# EAGLE design VisualightMicroDIY_02 (EAGLE 6.2)
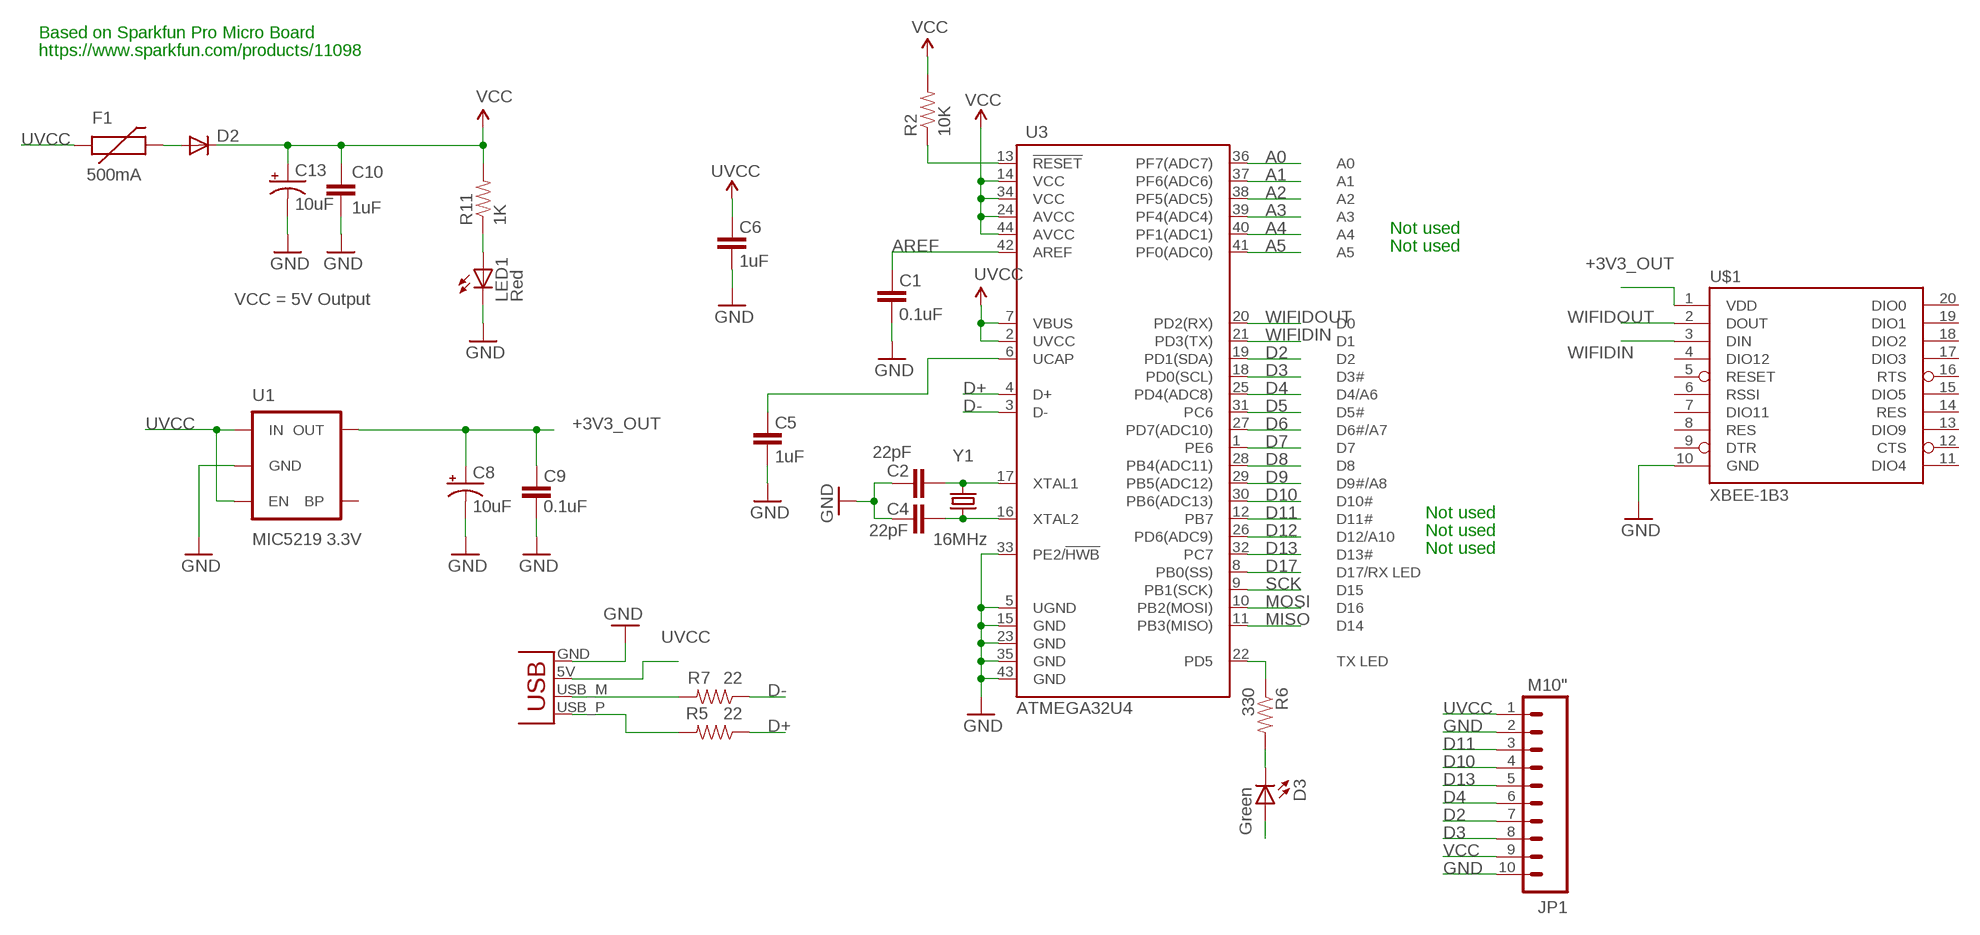
[diagram p0: schematic, sheet 1]

## Parts
C1  0.1uF  CAP0402-CAP  [0402-CAP]
C2  22pF  CAP0402-CAP  [0402-CAP]
C4  22pF  CAP0402-CAP  [0402-CAP]
C5  1uF  CAP0402-CAP  [0402-CAP]
C6  1uF  CAP0402-CAP  [0402-CAP]
C8  10uF  CAP_POL1206  [EIA3216]
C9  0.1uF  CAP0402-CAP  [0402-CAP]
C10  1uF  CAP0402-CAP  [0402-CAP]
C13  10uF  CAP_POL1206  [EIA3216]
D2  DIODESOD  [SOD-323]
D3  Green  LED0603  [LED-0603]
F1  500mA  PTCSMD  [PTC-1206]
JP1  M10"  [1X10]
LED1  Red  LED0603  [LED-0603]
R2  10K  RESISTOR0402-RES  [0402-RES]
R5  22  RESISTOR0402-RES  [0402-RES]
R6  330  RESISTOR0402-RES  [0402-RES]
R7  22  RESISTOR0402-RES  [0402-RES]
R11  1K  RESISTOR0402-RES  [0402-RES]
U1  MIC5219 3.3V  V_REG_MIC52193.3V  [SOT23-5]
U3  ATMEGA32U4  ATMEGA32U4TQFP  [SPARKFUN-DIGITALIC_TQFP44]
U$1  XBEE-1B3  [XBEE-SMD]
X2  USBPCB  [USB-A-PCB]
Y1  16MHz  CRYSTAL5X3  [CRYSTAL-SMD-5X3]

## Nets
+3V3_OUT: C8.A(+) C9.2 U1.5(OUT) U$1.1(VDD)
A0: U3.36(PF7(ADC7))
A1: U3.37(PF6(ADC6))
A2: U3.38(PF5(ADC5))
A3: U3.39(PF4(ADC4))
A4: U3.40(PF1(ADC1))
A5: U3.41(PF0(ADC0))
AREF: C1.2 U3.42(AREF)
D2: JP1.7 U3.19(PD1(SDA))
D3: JP1.8 U3.18(PD0(SCL))
D4: JP1.6 U3.25(PD4(ADC8))
D5: U3.31(PC6)
D6: U3.27(PD7(ADC10))
D7: U3.1(PE6)
D8: U3.28(PB4(ADC11))
D9: U3.29(PB5(ADC12))
D10: JP1.4 U3.30(PB6(ADC13))
D11: JP1.3 U3.12(PB7)
D12: U3.26(PD6(ADC9))
D13: JP1.5 U3.32(PC7)
D17: U3.8(PB0(SS))
D+: R5.1 U3.4(D+)
D-: R7.1 U3.3(D-)
GND [vcc]: C1.1 C2.2 C4.2 C5.1 C6.1 C8.C(-) C9.1 C10.2 C13.C(-) JP1.2 JP1.10 LED1.C U1.2(GND) U3.5(UGND) U3.15(GND) U3.23(GND) U3.33(PE2/!HWB) U3.35(GND) U3.43(GND) U$1.10(GND) X2.GND
MISO: U3.11(PB3(MISO))
MOSI: U3.10(PB2(MOSI))
N$1: C4.1 U3.16(XTAL2) Y1.1
N$2: C2.1 U3.17(XTAL1) Y1.3
N$4: C5.2 U3.6(UCAP)
N$6: R7.2 X2.USB_M(D-)
N$7: D3.C R6.2
N$8: R5.2 X2.USB_P(D+)
N$9: D2.2(A) F1.2
N$38: LED1.A R11.1
RESET: R2.1 U3.13(!RESET)
SCK: U3.9(PB1(SCK))
TXLED: R6.1 U3.22(PD5)
UVCC: C6.2 D3.A F1.1 JP1.1 U1.1(IN) U1.3(EN) U3.2(UVCC) U3.7(VBUS) X2.5V(VBUS)
VCC: C10.1 C13.A(+) D2.1(C) JP1.9 R2.2 R11.2 U3.14(VCC) U3.24(AVCC) U3.34(VCC) U3.44(AVCC)
WIFIDIN: U3.21(PD3(TX)) U$1.3(DIN)
WIFIDOUT: U3.20(PD2(RX)) U$1.2(DOUT)
Unconnected: U1.4(BP) U$1.4(DIO12) U$1.5(RESET) U$1.6(RSSI) U$1.7(DIO11) U$1.8(RES) U$1.9(DTR) U$1.11(DIO4) U$1.12(CTS) U$1.13(DIO9) U$1.14(RES) U$1.15(DIO5) U$1.16(RTS) U$1.17(DIO3) U$1.18(DIO2) U$1.19(DIO1) U$1.20(DIO0)

## Notes on the sheet
- Based on Sparkfun Pro Micro Board
- https://www.sparkfun.com/products/11098
- Not used
- Not used
- VCC = 5V Output
- Not used
- Not used
- Not used

## Library data of the parts
C1 C2 C4-C6 C9 C10 = SparkFun:CAP: Capacitor Standard 0603 ceramic capacitor, and 0.1" leaded capacitor.
C8 C13 = SparkFun:CAP_POL: Capacitor Polarized These are standard SMD and PTH capacitors. Normally 10uF, 47uF, and 100uF in electrolytic and tantalum varieties. Always verify the external diameter of the through hole cap, it varies with capacity, voltage, and manufacturer. The EIA devices should be standard.
D2 = SparkFun:DIODE: Diode These are standard reverse protection diodes and small signal diodes. SMA package can handle up to about 1A. SOD-323 can handle about 200mA. What the SOD-323 package when ordering, there are some mfgs out there that are 5-pin packages.
D3 LED1 = SparkFun:LED: LEDs Standard schematic elements and footprints for 5mm, 3mm, 1206, and 0603 sized LEDs. 5mm - Spark Fun Electronics SKU : COM-00529 (and others)
F1 = SparkFun:PTC: Resettable Fuse PTC Resettable Fuse. Spark Fun Electronics SKU : COM-08357
JP1 = SparkFun-Connectors:M10: Header 10 Standard 10-pin 0.1" header. Use with straight break away headers (SKU : PRT-00116), right angle break away headers (PRT-00553), swiss pins (PRT-00743), machine pins (PRT-00117), and female headers (PRT-00115).
R2 R5-R7 R11 = SparkFun:RESISTOR: Resistor Basic schematic elements and footprints for 0603, 1206, and PTH resistors.
U1 = SparkFun-PowerIC:V_REG_MIC5219: V_REG MIC5219 Standard 500mA LDO voltage regulator in SOT-23 layout. Micrel part MIC5219. BP (by-pass) pin is used to lower output noise with 470pF cap, may be left open.; PROD_ID: VREG-09872
U3 = SparkFun-DigitalIC:ATMEGA32U4: Atmel 44-pin 8-bit Microcontroller with 32KBytes of ISP Flash and USB Controller
U$1 = SparkFun-RF:XBEE-1: Xbee module footprints SMT header is CONN-09042.; PROD_ID: CONN-09042
X2 = SparkFun-Connectors:USB: USB Connectors USB-B-PTH is fully proven SKU : PRT-00139/CONN-08278 USB-miniB is fully proven SKU : PRT-00587 USB-A-PCB is untested. USB-A-H is throughly reviewed, but untested. Spark Fun Electronics SKU : PRT-00437 USB-B-SMT is throughly reviewed, but untested. Needs silkscreen touching up. USB-A-S has not been used/tested USB-MB-H has not been used/tested USB-MICROB has been used. CONN-09505
Y1 = SparkFun:CRYSTAL: Crystals Various standard crystals. Proven footprints. Spark Fun Electronics SKU : COM-00534

## Net classes
0 default: width 0.003 mm, drill 0.254 mm, clearance 0.152 mm

## Board
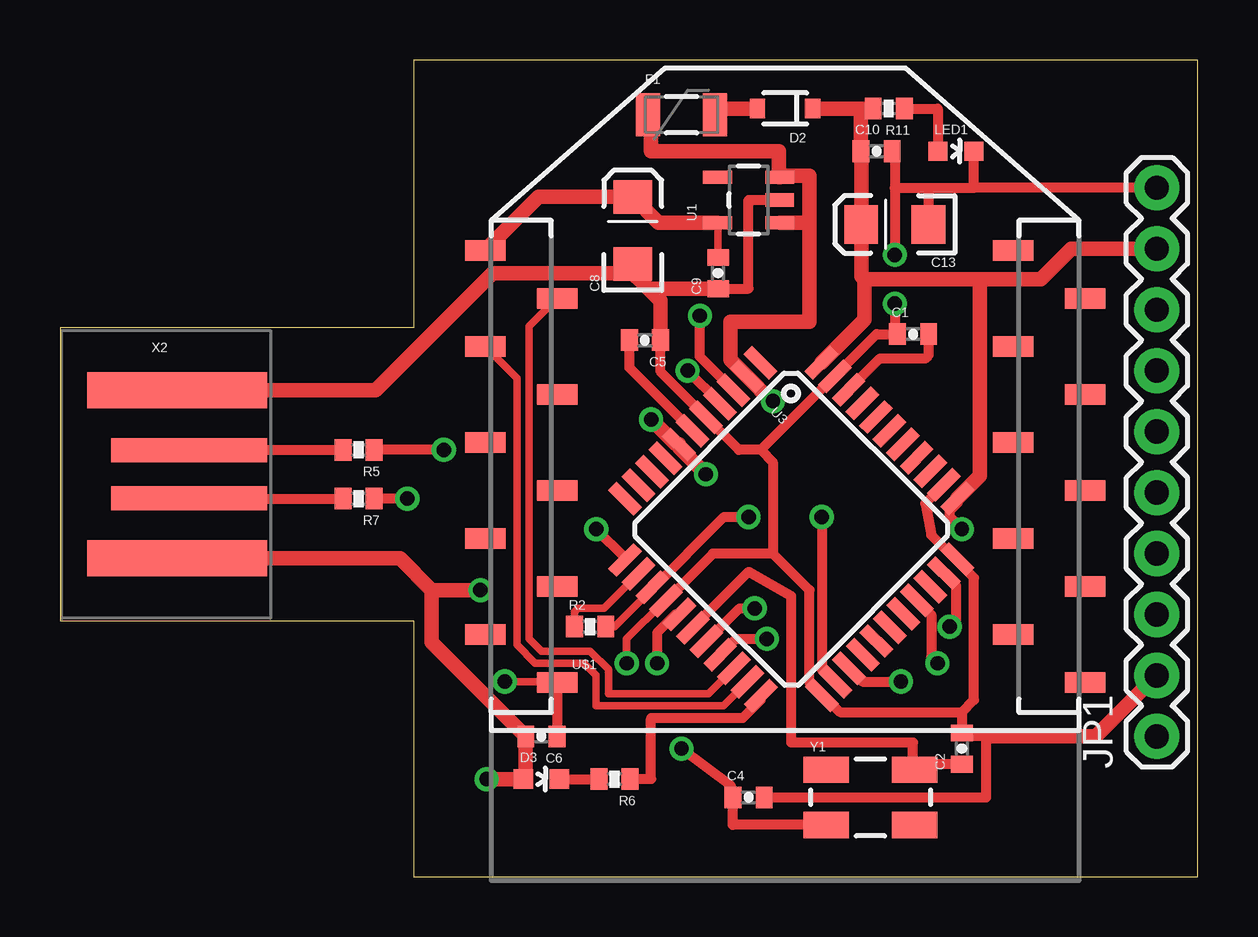
[diagram p1: board, top side]
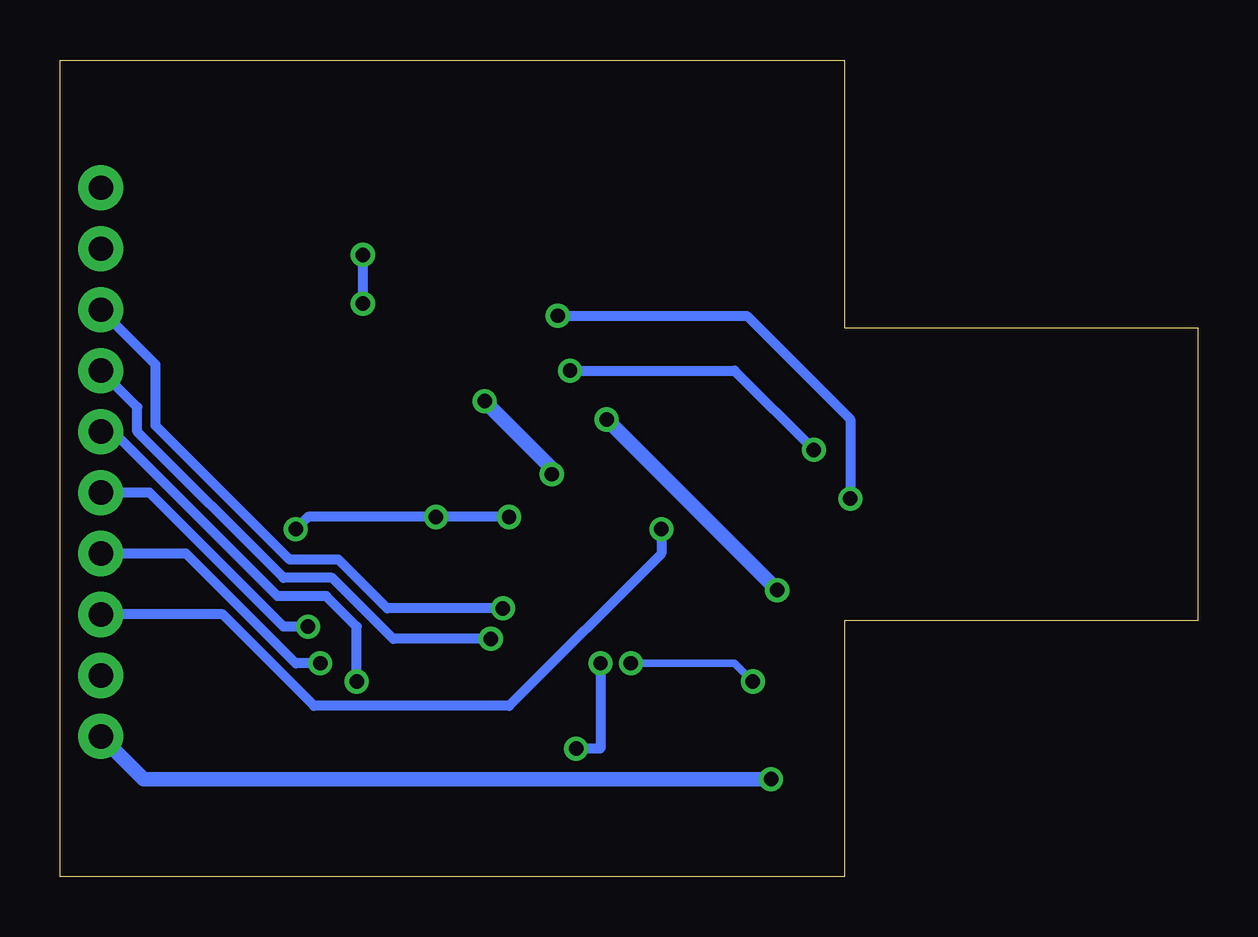
[diagram p2: board, bottom side, seen from below]

Size 47.42 x 34.03 mm. Coordinates in mm from the lower left corner, seen from the top.
Outline: 14.73,0 47.42,0 47.42,34.03 14.73,34.03 14.73,22.86 0,22.86 0,10.67 14.73,10.67 14.73,0
Copper layers (1*16): Top 0.035mm / dielectric 1.5mm / Bottom 0.035mm
Design rules: minimum track width 10mil, minimum drill 24mil, track to track 8mil, track to pad 8mil, pad to pad 8mil, via to via 8mil, smd to smd 8mil, copper to edge 40mil, drill to drill 8mil, minimum pad ring 10mil, minimum via ring 8mil, stop-mask expansion 4mil, vias tented up to drill 0mil, thermal gap 10mil

### Footprints (pad centres in the part's own frame; a part is rotated, then mirrored left to right if it is on the bottom)
0402-CAP = smd 0.7 x 0.9: 1 -0.65,0; 2 0.65,0
EIA3216 = smd 1.4 x 1.6: A 1.4,0; C -1.4,0
SOD-323 = smd 0.63 x 0.83: 1 -1.15,0; 2 1.15,0
LED-0603 = smd 0.8 x 0.8: A 0,-0.75; C 0,0.75
PTC-1206 = smd 1 x 1.8: 1 -1.4,0; 2 1.4,0
1X10 = drill 1.016 pad 1.88: 1 0,0; 2 2.54,0; 3 5.08,0; 4 7.62,0; 5 10.16,0; 6 12.7,0; 7 15.24,0; 8 17.78,0; 9 20.32,0; 10 22.86,0
0402-RES = smd 0.7 x 0.9: 1 -0.65,0; 2 0.65,0
SOT23-5 = smd 0.55 x 1.2: 1 -0.95,-1.3; 2 0,-1.3; 3 0.95,-1.3; 4 0.95,1.3; 5 -0.95,1.3
SPARKFUN-DIGITALIC_TQFP44 = smd 1.5 x 0.5: 1 -5.8,4; 2 -5.8,3.2; 3 -5.8,2.4; 4 -5.8,1.6; 5 -5.8,0.8; 6 -5.8,0; 7 -5.8,-0.8; 8 -5.8,-1.6; 9 -5.8,-2.4; 10 -5.8,-3.2; 11 -5.8,-4; 23 5.8,-4; 24 5.8,-3.2; 25 5.8,-2.4; 26 5.8,-1.6; 27 5.8,-0.8; 28 5.8,0; 29 5.8,0.8; 30 5.8,1.6; 31 5.8,2.4; 32 5.8,3.2; 33 5.8,4 | smd 0.5 x 1.5: 12 -4,-5.8; 13 -3.2,-5.8; 14 -2.4,-5.8; 15 -1.6,-5.8; 16 -0.8,-5.8; 17 0,-5.8; 18 0.8,-5.8; 19 1.6,-5.8; 20 2.4,-5.8; 21 3.2,-5.8; 22 4,-5.8; 34 4,5.8; 35 3.2,5.8; 36 2.4,5.8; 37 1.6,5.8; 38 0.8,5.8; 39 0,5.8; 40 -0.8,5.8; 41 -1.6,5.8; 42 -2.4,5.8; 43 -3.2,5.8; 44 -4,5.8
XBEE-SMD = smd 1.7 x 0.85: 1 -12.5,20; 2 -9.5,18; 3 -12.5,16; 4 -9.5,14; 5 -12.5,12; 6 -9.5,10; 7 -12.5,8; 8 -9.5,6; 9 -12.5,4; 10 -9.5,2; 11 12.5,2; 12 9.5,4; 13 12.5,6; 14 9.5,8; 15 12.5,10; 16 9.5,12; 17 12.5,14; 18 9.5,16; 19 12.5,18; 20 9.5,20
USB-A-PCB = smd 7.5 x 1.5: 5V -0.2,-3.5; GND -0.2,3.5 | smd 6.5 x 1: USB_M 0.3,-1; USB_P 0.3,1
CRYSTAL-SMD-5X3 = smd 1.9 x 1.1: 1 -1.85,-1.15; 2 1.85,-1.15; 3 1.85,1.15; 4 -1.85,1.15

### Placement (x,y rotation side)
C1  35.56,22.61 0 top
C2  37.59,5.33 90 top
C4  28.7,3.3 0 top
C5  24.38,22.35 180 top
C6  20.07,5.84 180 top
C8  23.88,26.92 90 top
C9  27.43,25.15 90 top
C10  34.04,30.23 0 top
C13  34.8,27.18 180 top
D2  30.23,32 180 top
D3  20.07,4.06 270 top
F1  25.91,31.75 0 top
JP1  45.72,5.84 90 top
LED1  37.34,30.23 270 top
R2  22.1,10.41 0 top
R5  12.45,17.78 180 top
R6  23.11,4.06 180 top
R7  12.45,15.75 180 top
R11  34.54,32 180 top
U1  28.7,28.19 90 top
U3  30.48,14.48 315.1 top
U$1  30.23,6.1 0 top
X2  5.08,16.76 0 top
Y1  33.78,3.3 0 top

### Tracks (layer width: path | path; a pad name or v marks a point on that pad's centre or on a via)
+3V3_OUT
  Top 0.305: U1.5 27.43,27.24 C9.2
  Top 0.61: U$1.1 19.95,28.32 C8.A 24.96,27.24 U1.5
AREF
  Top 0.406: U3.42 34.18,21.59 36.07,21.59 36.21,21.73 C1.2
D2  (via drill 0.6)
  Top 0.406: U3.19 28.19,9.91 v29.46,9.91
  Bottom 0.406: v29.46,9.91 33.53,9.91 36.07,12.45 38.1,12.45 44.2,18.54 44.2,19.56 JP1.7
D3  (via drill 0.6)
  Top 0.406: U3.18 28.32,11.18 v28.96,11.18
  Bottom 0.406: v28.96,11.18 33.78,11.18 35.81,13.21 37.85,13.21 43.43,18.8 43.43,21.34 JP1.8
D4  (via drill 0.6)
  Top 0.406: U3.25 33.45,8.13 v35.05,8.13
  Bottom 0.406: v35.05,8.13 35.05,10.41 36.32,11.68 38.35,11.68 45.21,18.54 JP1.6
D10  (via drill 0.6)
  Top 0.406: U3.30 36.32,10.91 36.32,9.14 v36.58,8.89
  Bottom 0.406: v36.58,8.89 37.59,8.89 42.16,13.46 JP1.4
D11  (via drill 0.6)
  Top 0.406: U3.12 23.55,13.28 v22.35,14.48
  Bottom 0.406: v22.35,14.48 22.35,13.46 28.7,7.11 36.83,7.11 40.64,10.92 JP1.3
D13  (via drill 0.6)
  Top 0.406: U3.32 37.34,12.16 37.34,10.67 v37.08,10.41
  Bottom 0.406: v37.08,10.41 38.1,10.41 43.69,16 JP1.5
D+  (via drill 0.6)
  Top 0.406: U3.4 27.5,19.74 v26.16,21.08 | v16,17.78 R5.1
  Bottom 0.406: v26.16,21.08 19.3,21.08 v16,17.78
D-  (via drill 0.6)
  Top 0.406: U3.3 26.67,21.67 v26.67,23.37 | v14.48,15.75 R7.1
  Bottom 0.406: v26.67,23.37 18.8,23.37 14.48,19.05 v14.48,15.75
GND  (via drill 0.6)
  Top 0.305: U$1.10 20.57,8.13 v18.54,8.13 | v23.62,8.89 23.62,9.91 25.15,11.43 U3.15
  Top 0.406: U$1.10 C6.1 | 37.59,6.86 32.51,6.86 31.82,7.55 U3.23 31.24,8.07 31.24,11.94 29.72,13.46 | 37.59,6.86 C2.2 37.59,5.84 38.61,5.84 38.61,3.3 C4.2 | 37.59,6.86 38.1,7.37 38.1,12.45 37.41,13.13 U3.33 37.33,13.22 36.32,14.22 36.07,15.55 U3.35 | 34.8,28.7 34.8,30.23 C10.2 | 36.2,28.7 38.09,28.7 | 38.09,28.7 LED1.C | 34.8,28.7 36.2,28.7 | 36.2,28.7 C13.C | 34.8,22.61 34.04,22.61 32.51,21.08 U3.43 32.27,20.84 29.21,17.78 | 34.8,22.61 C1.1 | v34.8,23.88 34.8,22.61 | 34.8,28.7 v34.8,25.91 | C9.1 28.7,24.5 28.7,28.19 U1.2 | JP1.10 38.09,28.7 | C5.1 25.03,21.04 U3.5 28.3,17.78 29.21,17.78 | 29.72,13.46 27.22,13.46 U3.15 | 29.21,17.78 29.72,17.27 29.72,13.46 | C8.C 23.62,25.52 23.62,25.4
  Top 0.61: JP1.2 43.18,5.84 38.61,5.84 | X2.GND 13.15,20.26 18.03,25.15 23.88,25.15 | 23.88,25.15 C8.C | 23.88,25.15 25.03,23.99 C5.1 | C9.1 24.53,24.5 23.62,25.4
  Bottom 0.305: v18.54,8.13 19.3,8.89 v23.62,8.89
  Bottom 0.406: v34.8,25.91 v34.8,23.88
N$1  (via drill 0.6)
  Top 0.406: v24.89,8.89 24.89,10.16 25.65,10.92 U3.16 | v25.91,5.33 27.94,3.81 C4.1 28.05,2.15 Y1.1
  Bottom 0.406: v24.89,8.89 24.89,5.33 v25.91,5.33
N$2
  Top 0.406: Y1.3 35.56,4.45 35.56,4.68 | 35.56,4.68 35.56,5.59 30.48,5.59 30.48,11.68 28.7,12.7 26.42,10.41 26.42,10.4 U3.17 | C2.1 35.56,4.68
N$4
  Top 0.406: U3.6 23.73,21.21 C5.2
N$6
  Top 0.305: X2.USB_M 5.4,15.75
  Top 0.406: 5.4,15.75 R7.2
N$7
  Top 0.406: D3.C R6.2
N$8
  Top 0.305: X2.USB_P 5.4,17.78
  Top 0.406: 5.4,17.78 R5.2
N$9
  Top 0.305: 27.69,32 27.43,31.75 F1.2
  Top 0.61: D2.2 27.69,32
N$16  (via drill 0.6)
  other vias: 22.35,14.48
N$18  (via drill 0.6)
  other vias: 35.05,8.13
N$19  (via drill 0.6)
  other vias: 37.08,10.41
N$20  (via drill 0.6)
  other vias: 36.58,8.89
N$38
  Top 0.406: R11.1 36.59,32 LED1.A
RESET
  Top 0.305: U3.13 22.67,11.18 21.59,11.18 21.45,11.03 R2.1
TXLED
  Top 0.406: U3.22 29.21,7.37 28.45,6.6 24.64,6.6 24.64,4.06 R6.1
UVCC  (via drill 0.6)
  Top 0.305: 30.23,29.21 30.16,29.14 U1.3 | 24.64,30.99 24.51,31.12 F1.1
  Top 0.61: 31.24,27.18 31.24,23.11 27.94,23.11 27.94,21.53 U3.2 29.66,19.81 v29.72,19.81 | 31.24,27.18 31.24,29.21 30.23,29.21 | U1.3 29.97,29.14 29.97,30.23 24.64,30.23 24.64,30.99 | U1.1 31.18,27.24 31.24,27.18 | X2.5V 14.17,13.26 15.49,11.94 | 15.49,11.94 15.49,9.76 C6.2 19.42,4.16 D3.A v17.78,4.06 | v24.64,19.05 25.68,18.01 U3.7 25.81,17.88 v26.92,16.76 | v17.53,11.94 15.49,11.94
  Bottom 0.61: v24.64,19.05 v17.53,11.94 | v26.92,16.76 26.92,17.02 v29.72,19.81 | JP1.1 43.94,4.06 v17.78,4.06
VCC  (via drill 0.6)
  Top 0.305: R2.2 23.11,10.41 24.64,11.94
  Top 0.406: U3.14 24.64,11.94 27.69,14.99 v28.7,14.99 | v37.59,14.48 37.08,14.99 37.08,15.24 37.41,15.56 U3.34 | v31.75,14.99 31.75,8.64 32.27,8.12 U3.24
  Top 0.61: D2.1 R11.2 33.39,32 C10.1 33.4,29.72 C13.A 33.4,25.02 33.53,24.89 | 38.35,24.89 40.89,24.89 42.16,26.16 JP1.9 | 33.53,24.89 38.35,24.89 | 38.35,24.89 38.35,16.71 U3.34 | 33.53,24.89 33.53,23.2 U3.44
  Bottom 0.406: v37.59,14.48 37.08,14.99 v31.75,14.99 v28.7,14.99
WIFIDIN
  Top 0.305: U$1.3 19.05,20.77 19.05,9.65 19.81,8.89 21.84,8.89 22.35,8.38 22.35,7.11 27.65,7.11 U3.21
WIFIDOUT
  Top 0.305: U$1.2 19.56,22.93 19.56,9.91 20.07,9.4 22.1,9.4 22.86,8.64 22.86,7.62 27.03,7.62 U3.20